# Altium schematic sheet 01- Power Regulators.SchDoc: Power Regulators
size A3; Page Number: 1; Page Size: B; Page Count: 12; Board Rev: B; Project Name: CrossLink-NX Evaluation Board; RevCode: 1.0; Doc: 305-PD-19-0819; DsnPath: C:\Users\HAltinkilit\Downloads\Crosslink-NX-Design-Files\CrossLink-NX-Eval-Brd-Schematic-RevB-191122.DSN; SchematicName: SCHEMATIC1; PageName: 13 - Power Regulators; PageSize: B; TopSchematic: True
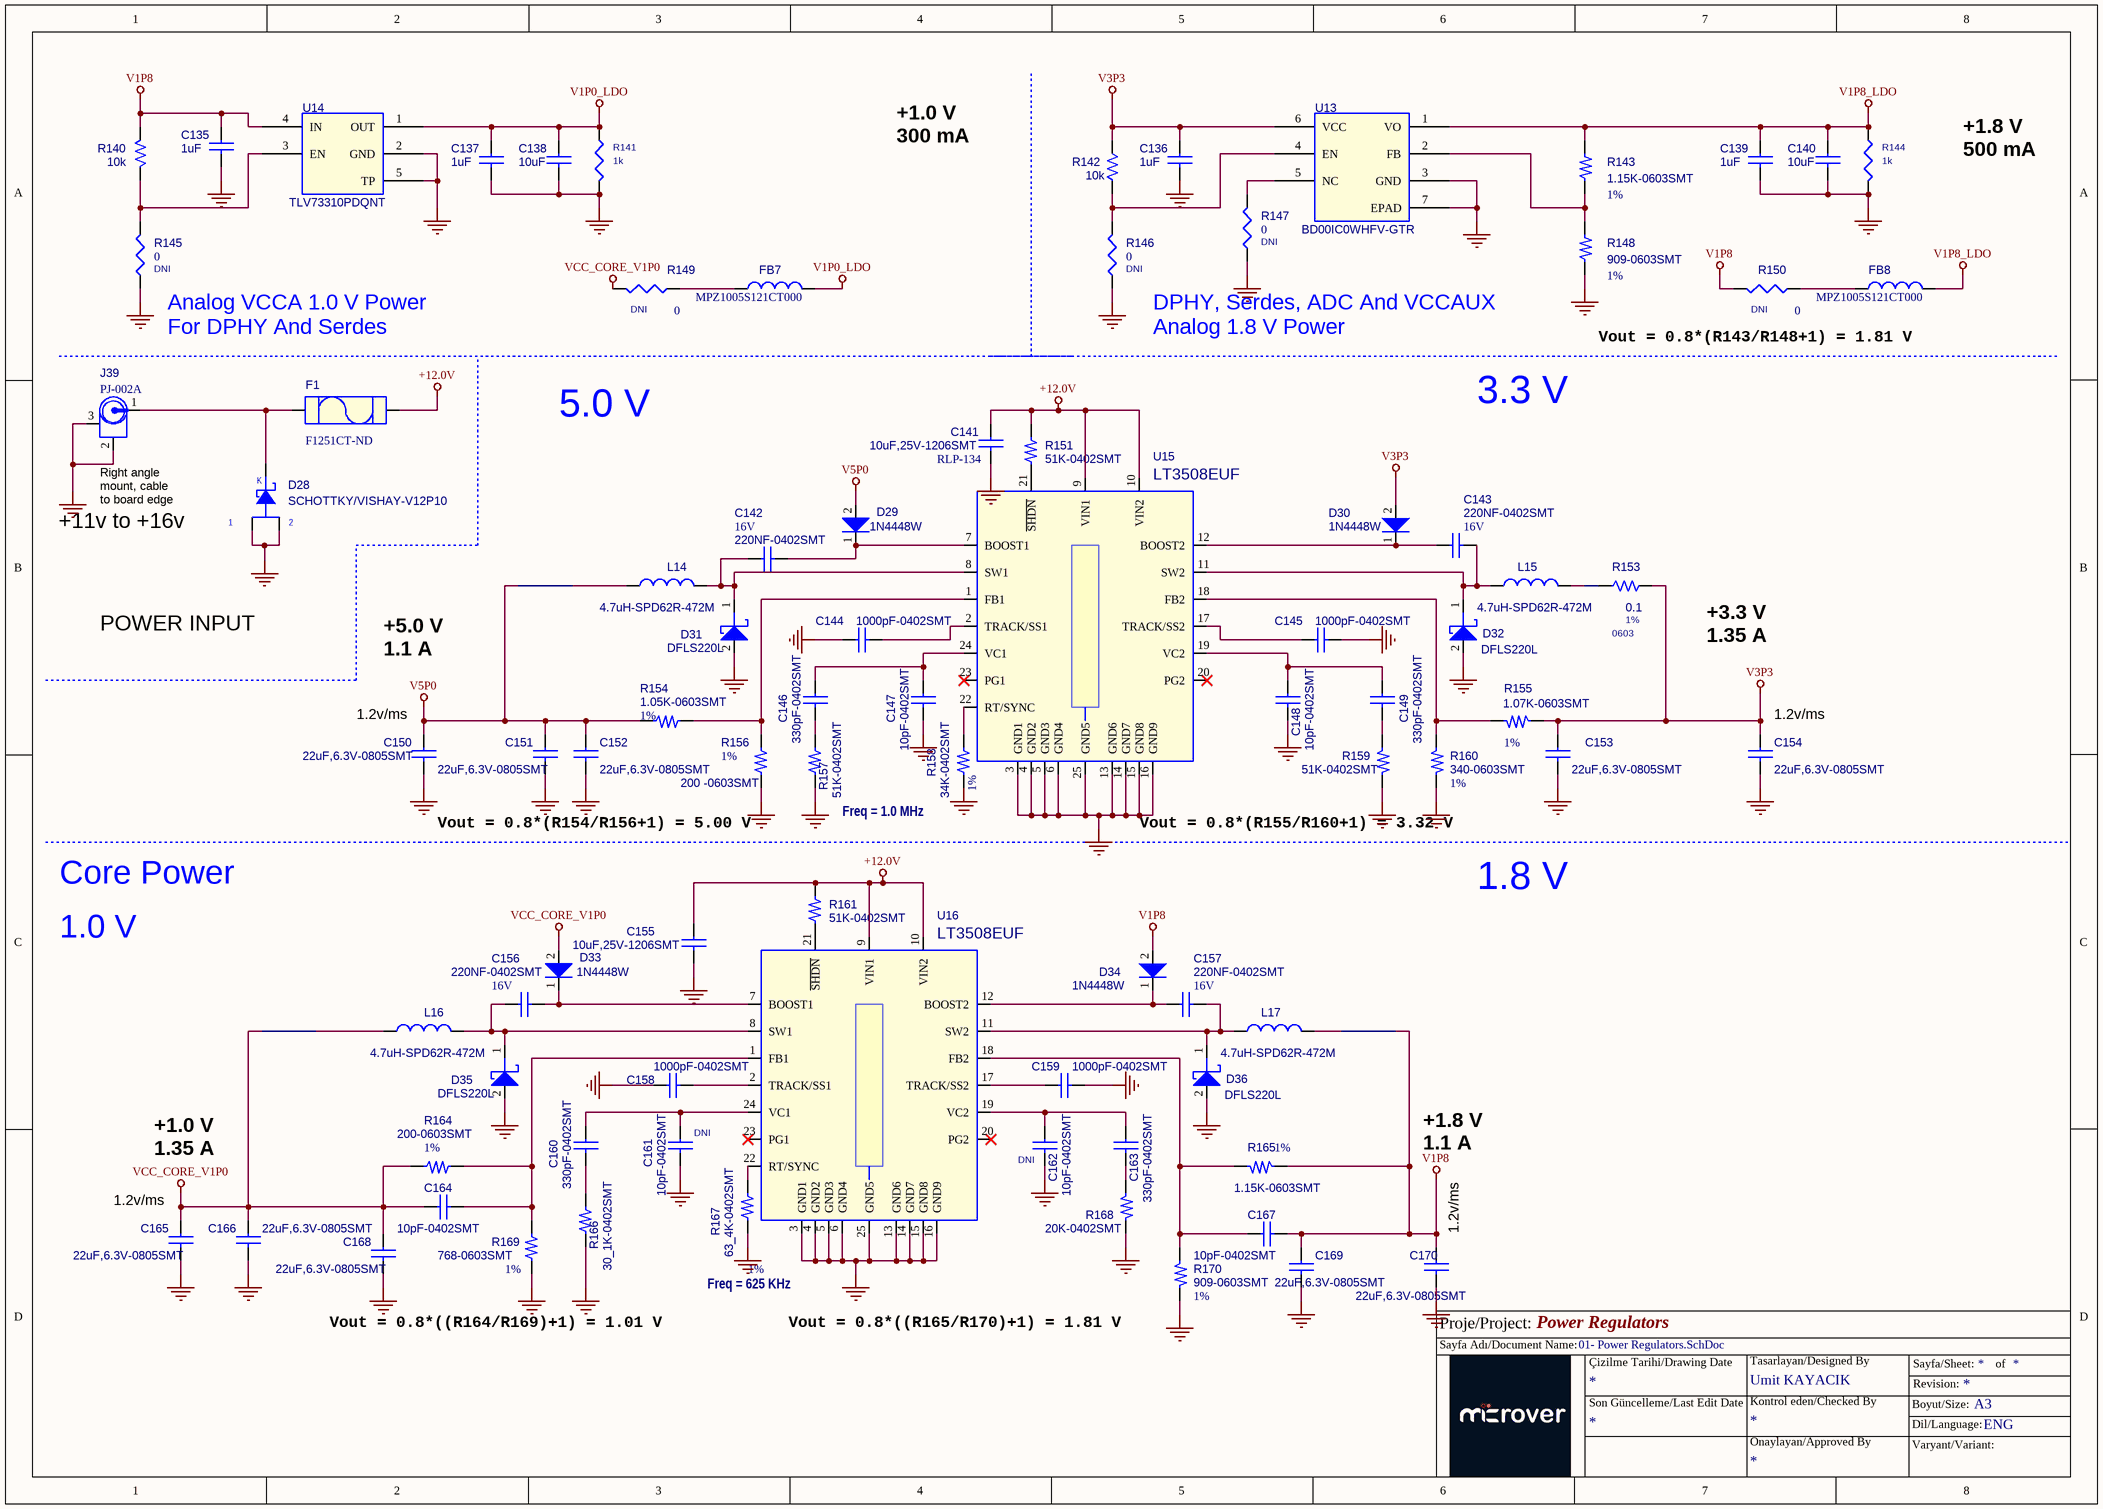
[diagram p0: 01- Power Regulators.SchDoc]

## Parts
C135  1uF  [C0603]
C136  1uF  [C0603]
C137  1uF  [C0603]
C138  10uF  [C0603]
C139  1uF  [C0603]
C140  10uF  [C0603]
C141  10uF,25V-1206SMT  [RLP-134]
C142  220NF-0402SMT  COMPFIXED: 16V  [RLP-130-A]
C143  220NF-0402SMT  COMPFIXED: 16V  [RLP-130-A]
C144  1000pF-0402SMT  [RLP-130-A]
C145  1000pF-0402SMT  [RLP-130-A]
C146  330pF-0402SMT  [RLP-130-A]
C147  10pF-0402SMT  [RLP-130-A]
C148  10pF-0402SMT  [RLP-130-A]
C149  330pF-0402SMT  [RLP-130-A]
C150  22uF,6.3V-0805SMT  [RLP-133]
C151  22uF,6.3V-0805SMT  [RLP-133]
C152  22uF,6.3V-0805SMT  [RLP-133]
C153  22uF,6.3V-0805SMT  [RLP-133]
C154  22uF,6.3V-0805SMT  [RLP-133]
C155  10uF,25V-1206SMT  [RLP-134]
C156  220NF-0402SMT  COMPFIXED: 16V  [RLP-130-A]
C157  220NF-0402SMT  COMPFIXED: 16V  [RLP-130-A]
C158  1000pF-0402SMT  [RLP-130-A]
C159  1000pF-0402SMT  [RLP-130-A]
C160  330pF-0402SMT  [RLP-130-A]
C161  10pF-0402SMT  Populate: DNI  [RLP-130-A]
C162  10pF-0402SMT  Populate: DNI  [RLP-130-A]
C163  330pF-0402SMT  [RLP-130-A]
C164  10pF-0402SMT  [RLP-130-A]
C165  22uF,6.3V-0805SMT  [RLP-133]
C166  22uF,6.3V-0805SMT  [RLP-133]
C167  10pF-0402SMT  [RLP-130-A]
C168  22uF,6.3V-0805SMT  [RLP-133]
C169  22uF,6.3V-0805SMT  [RLP-133]
C170  22uF,6.3V-0805SMT  [RLP-133]
D28  SCHOTTKY/VISHAY-V12P10  [V12P10]
D29  1N4448W  [1N4448W]
D30  1N4448W  [1N4448W]
D31  DFLS220L  [DFLS220L]
D32  DFLS220L  [DFLS220L]
D33  1N4448W  [1N4448W]
D34  1N4448W  [1N4448W]
D35  DFLS220L  [DFLS220L]
D36  DFLS220L  [DFLS220L]
F1  F1251CT-ND  [0154010]
FB7  MPZ1005S121CT000  [FB0402]
FB8  MPZ1005S121CT000  [FB0402]
J39  PJ-002A  [pj_002a_3p]
L14  4.7uH-SPD62R-472M  [SPD62R]
L15  4.7uH-SPD62R-472M  [SPD62R]
L16  4.7uH-SPD62R-472M  [SPD62R]
L17  4.7uH-SPD62R-472M  [SPD62R]
R140  10k  [R0402]
R141  1k  [R0402]
R142  10k  [R0402]
R143  1.15K-0603SMT  COMPFIXED: 1%  [RLP-101]
R144  1k  [R0402]
R145  0  Assy: DNI  [R0402]
R146  0  Assy: DNI  [R0603]
R147  0  Assy: DNI  [R0603]
R148  909-0603SMT  COMPFIXED: 1%  [RLP-101]
R149  0  Assy: DNI  [R0603]
R150  0  Assy: DNI  [R0603]
R151  51K-0402SMT  [RLP-100]
R153  0.1  Tollerance: 1%  [0603]
R154  1.05K-0603SMT  COMPFIXED: 1%  [RLP-101]
R155  1.07K-0603SMT  COMPFIXED: 1%  [RLP-101]
R156  200 -0603SMT  COMPFIXED: 1%  [RLP-101]
R157  51K-0402SMT  [RLP-100]
R158  34K-0402SMT  COMPGROUP: Freq = 1.0 MHz  COMPFIXED: 1%  [RLP-100]
R159  51K-0402SMT  [RLP-100]
R160  340-0603SMT  COMPFIXED: 1%  [RLP-101]
R161  51K-0402SMT  [RLP-100]
R164  200-0603SMT  COMPFIXED: 1%  [RLP-101]
R165  1.15K-0603SMT  COMPFIXED: 1%  [RLP-101]
R166  30_1K-0402SMT  [RLP-100]
R167  63_4K-0402SMT  COMPGROUP: Freq = 625 KHz  COMPFIXED: 1%  [RLP-100]
R168  20K-0402SMT  [RLP-100]
R169  768-0603SMT  COMPFIXED: 1%  [RLP-101]
R170  909-0603SMT  COMPFIXED: 1%  [RLP-101]
U13  BD00IC0WHFV-GTR  [6HVSOF_BD00IC0WHFV]
U14  TLV73310PDQNT  [4X2SON]
U15  LT3508EUF  [LT3508EUF]
U16  LT3508EUF  [LT3508EUF]

## Nets
+12.0V: C141.1 C155.1 F1.2 R151.1 R161.1 U15.9(VIN1) U15.10(VIN2) U16.9(VIN1) U16.10(VIN2)
GND: C135.2 C136.2 C137.2 C138.2 C139.2 C140.2 C141.2 C144.1 C145.2 C147.2 C148.2 C150.2 C151.2 C152.2 C153.2 C154.2 C155.2 C158.1 C159.2 C161.2 C162.2 C165.2 C166.2 C168.2 C169.2 C170.2 D28.1(Anode1) D28.2(Anode2) D31.2 D32.2 D35.2 D36.2 J39.2(GND) J39.3(GND) R141.2 R144.2 R145.2 R146.2 R147.2 R148.1 R156.2 R157.2 R158.2 R159.2 R160.2 R166.2 R167.2 R168.2 R169.2 R170.2 U13.3(GND) U13.7(EPAD) U14.2(GND) U14.5(TP) U15.3(GND1) U15.4(GND2) U15.5(GND3) U15.6(GND4) U15.13(GND6) U15.14(GND7) U15.15(GND8) U15.16(GND9) U15.25(GND5) U16.3(GND1) U16.4(GND2) U16.5(GND3) U16.6(GND4) U16.13(GND6) U16.14(GND7) U16.15(GND8) U16.16(GND9) U16.25(GND5)
V1P0_LDO: C137.1 C138.1 FB7.2 R141.1 U14.1(OUT)
V1P8: C135.1 C167.2 C169.1 C170.1 D34.2 L17.1 R140.2 R150.2 R165.1 U14.4(IN)
V1P8_LDO: C139.1 C140.1 FB8.2 R143.2 R144.1 U13.1(VO)
V3P3: C136.1 C153.1 C154.1 D30.2 R142.2 R153.2 R155.1 U13.6(VCC)
V5P0: C150.1 C151.1 C152.1 D29.2 L14.1 R154.1
VCC_CORE_V1P0: C164.1 C165.1 C166.1 C168.1 D33.2 L16.1 R149.2 R164.1
NetC142_1: C142.1 D31.1 L14.2 U15.8(SW1)
NetC142_2: C142.2 D29.1 U15.7(BOOST1)
NetC143_1: C143.1 D30.1 U15.12(BOOST2)
NetC143_2: C143.2 D32.1 L15.2 U15.11(SW2)
NetC144_2: C144.2 U15.2(TRACK/SS1)
NetC145_1: C145.1 U15.17(TRACK/SS2)
NetC146_1: C146.1 C147.1 U15.24(VC1)
NetC146_2: C146.2 R157.1
NetC148_1: C148.1 C149.1 U15.19(VC2)
NetC149_2: C149.2 R159.1
NetC156_1: C156.1 D35.1 L16.2 U16.8(SW1)
NetC156_2: C156.2 D33.1 U16.7(BOOST1)
NetC157_1: C157.1 D34.1 U16.12(BOOST2)
NetC157_2: C157.2 D36.1 L17.2 U16.11(SW2)
NetC158_2: C158.2 U16.2(TRACK/SS1)
NetC159_1: C159.1 U16.17(TRACK/SS2)
NetC160_1: C160.1 C161.1 U16.24(VC1)
NetC160_2: C160.2 R166.1
NetC162_1: C162.1 C163.1 U16.19(VC2)
NetC163_2: C163.2 R168.1
NetC164_2: C164.2 R164.2 R169.1 U16.1(FB1)
NetC167_1: C167.1 R165.2 R170.1 U16.18(FB2)
NetD28_3: D28.3(K) F1.1 J39.1(+5V)
NetFB7_1: FB7.1 R149.1
NetFB8_1: FB8.1 R150.1
NetL15_1: L15.1 R153.1
NetR140_1: R140.1 R145.1 U14.3(EN)
NetR142_1: R142.1 R146.1 U13.4(EN)
NetR143_1: R143.1 R148.2 U13.2(FB)
NetR147_1: R147.1 U13.5(NC)
NetR151_2: R151.2 U15.21(~{SHDN})
NetR154_2: R154.2 R156.1 U15.1(FB1)
NetR155_2: R155.2 R160.1 U15.18(FB2)
NetR158_1: R158.1 U15.22(RT/SYNC)
NetR161_2: R161.2 U16.21(~{SHDN})
NetR167_1: R167.1 U16.22(RT/SYNC)

Not connected (* = marked no-connect by the designer): U15 20(PG2)* 23(PG1)*; U16 20(PG2)* 23(PG1)*

## Notes on the sheet
- +1.0 V
  300 mA
- +1.8 V
  500 mA
- (near R145) Analog VCCA 1.0 V Power
  For DPHY And Serdes
- DPHY, Serdes, ADC And VCCAUX
  Analog 1.8 V Power
- Vout = 0.8*(R143/R148+1) = 1.81 V
- 5.0 V
- 3.3 V
- (near J39) Right angle
  mount, cable
  to board edge
- (near D28) K
- +11v to +16v
- (near D28) 1
- (near D28) 2
- POWER INPUT
- +5.0 V
  1.1 A
- +3.3 V
  1.35 A
- (near C150) 1.2v/ms
- (near C154) 1.2v/ms
- Vout = 0.8*(R154/R156+1) = 5.00 V
- Vout = 0.8*(R155/R160+1) = 3.32 V
- Core Power
- 1.8 V
- 1.0 V
- +1.0 V
  1.35 A
- +1.8 V
  1.1 A
- (near C165) 1.2v/ms
- (near C170) 1.2v/ms
- Vout = 0.8*((R164/R169)+1) = 1.01 V
- Vout = 0.8*((R165/R170)+1) = 1.81 V
- Proje/Project:
- Sayfa Adı/Document Name:
- Çizilme Tarihi/Drawing Date
- Umit KAYACIK
- Tasarlayan/Designed By
- Sayfa/Sheet:
- Revision:
- of
- Son Güncelleme/Last Edit Date
- Kontrol eden/Checked By
- Onaylayan/Approved By
- Boyut/Size:
- Varyant/Variant:
- Dil/Language:
- A3
- ENG

## Library data of the parts
C135 = CAP NP: CAP CER 10UF 10V 20% X6S 0603; Part Reference: C135; Manufacturer Part Number: CL10X106MP8NRNC; Manufacturer: Samsung; Value: 1uF; MFG P/N: CL10X106MP8NRNC; Man. Part #: CL10X106MP8NRNC; MFG: Samsung; Assy: -; PCB Footprint: C0603
C136 = CAP NP: CAP CER 10UF 10V 20% X6S 0603; Part Reference: C136; Manufacturer Part Number: CL10X106MP8NRNC; Manufacturer: Samsung; Value: 1uF; MFG P/N: CL10X106MP8NRNC; Man. Part #: CL10X106MP8NRNC; MFG: Samsung; Assy: -; PCB Footprint: C0603
C137 = CAP NP: CAP CER 10UF 10V 20% X6S 0603; Part Reference: C137; Manufacturer Part Number: CL10X106MP8NRNC; Manufacturer: Samsung; Value: 1uF; Assy: -; MFG P/N: CL10X106MP8NRNC; Man. Part #: CL10X106MP8NRNC; MFG: Samsung; PCB Footprint: C0603
C138 = CAP NP: CAP CER 10UF 10V 20% X6S 0603; Part Reference: C138; Man. Part #: CL10X106MP8NRNC; MFG: Samsung; Value: 10uF; Assy: -; Manufacturer: Samsung; MFG P/N: CL10X106MP8NRNC; Manufacturer Part Number: CL10X106MP8NRNC; PCB Footprint: C0603
C139 = CAP NP: CAP CER 10UF 10V 20% X6S 0603; Part Reference: C139; Man. Part #: CL10X106MP8NRNC; MFG: Samsung; Value: 1uF; Assy: -; Manufacturer: Samsung; MFG P/N: CL10X106MP8NRNC; Manufacturer Part Number: CL10X106MP8NRNC; PCB Footprint: C0603
C140 = CAP NP: CAP CER 10UF 10V 20% X6S 0603; Part Reference: C140; Man. Part #: CL10X106MP8NRNC; MFG: Samsung; Value: 10uF; Assy: -; Manufacturer: Samsung; MFG P/N: CL10X106MP8NRNC; Manufacturer Part Number: CL10X106MP8NRNC; PCB Footprint: C0603
C141 = CAP-NP: Part Reference: C141; Value: 10uF,25V-1206SMT; Assy: -; PCB Footprint: RLP-134
C142 = CAP-NP: Part Reference: C142; Value: 220NF-0402SMT; Assy: -; PCB Footprint: RLP-130-A
C143 = CAP-NP: Part Reference: C143; Value: 220NF-0402SMT; Assy: -; PCB Footprint: RLP-130-A
C144 = CAP-NP: Part Reference: C144; Value: 1000pF-0402SMT; Assy: -; PCB Footprint: RLP-130-A
C145 = CAP-NP: Part Reference: C145; Value: 1000pF-0402SMT; Assy: -; PCB Footprint: RLP-130-A
C146 = CAP-NP: Part Reference: C146; Value: 330pF-0402SMT; Assy: -; PCB Footprint: RLP-130-A
C147 = CAP-NP: Part Reference: C147; Value: 10pF-0402SMT; Assy: -; PCB Footprint: RLP-130-A
C148 = CAP-NP: Part Reference: C148; Value: 10pF-0402SMT; Assy: -; PCB Footprint: RLP-130-A
C149 = CAP-NP: Part Reference: C149; Value: 330pF-0402SMT; Assy: -; PCB Footprint: RLP-130-A
C150 = CAP-NP: CAP CER 22UF 10V X5R 0805; Part Reference: C150; Manufacturer: Samsung; Manufacturer Part Number: CL21A226KPCLRNC; Value: 22uF,6.3V-0805SMT; Assy: -; PCB Footprint: RLP-133
C151 = CAP-NP: CAP CER 22UF 10V X5R 0805; Part Reference: C151; Manufacturer: Samsung; Manufacturer Part Number: CL21A226KPCLRNC; Value: 22uF,6.3V-0805SMT; Assy: -; PCB Footprint: RLP-133
C152 = CAP-NP: CAP CER 22UF 10V X5R 0805; Part Reference: C152; Manufacturer: Samsung; Manufacturer Part Number: CL21A226KPCLRNC; Value: 22uF,6.3V-0805SMT; Assy: -; PCB Footprint: RLP-133
C153 = CAP-NP: CAP CER 22UF 10V X5R 0805; Part Reference: C153; Manufacturer Part Number: CL21A226KPCLRNC; Manufacturer: Samsung; Value: 22uF,6.3V-0805SMT; Assy: -; PCB Footprint: RLP-133
C154 = CAP-NP: CAP CER 22UF 10V X5R 0805; Part Reference: C154; Manufacturer Part Number: CL21A226KPCLRNC; Manufacturer: Samsung; Value: 22uF,6.3V-0805SMT; Assy: -; PCB Footprint: RLP-133
C155 = CAP-NP: Part Reference: C155; Value: 10uF,25V-1206SMT; Assy: -; PCB Footprint: RLP-134
C156 = CAP-NP: Part Reference: C156; Value: 220NF-0402SMT; Assy: -; PCB Footprint: RLP-130-A
C157 = CAP-NP: Part Reference: C157; Value: 220NF-0402SMT; Assy: -; PCB Footprint: RLP-130-A
C158 = CAP-NP: Part Reference: C158; Value: 1000pF-0402SMT; Assy: -; PCB Footprint: RLP-130-A
C159 = CAP-NP: Part Reference: C159; Value: 1000pF-0402SMT; Assy: -; PCB Footprint: RLP-130-A
C160 = CAP-NP: Part Reference: C160; Value: 330pF-0402SMT; Assy: -; PCB Footprint: RLP-130-A
C161 = CAP-NP: Part Reference: C161; ASSY: DNI; Value: 10pF-0402SMT; PCB Footprint: RLP-130-A
C162 = CAP-NP: Part Reference: C162; ASSY: DNI; Value: 10pF-0402SMT; PCB Footprint: RLP-130-A
C163 = CAP-NP: Part Reference: C163; Value: 330pF-0402SMT; Assy: -; PCB Footprint: RLP-130-A
C164 = CAP-NP: Part Reference: C164; Value: 10pF-0402SMT; Assy: -; PCB Footprint: RLP-130-A
C165 = CAP-NP: CAP CER 22UF 10V X5R 0805; Part Reference: C165; Manufacturer Part Number: CL21A226KPCLRNC; Manufacturer: Samsung; Value: 22uF,6.3V-0805SMT; Assy: -; PCB Footprint: RLP-133
C166 = CAP-NP: CAP CER 22UF 10V X5R 0805; Part Reference: C166; Manufacturer: Samsung; Manufacturer Part Number: CL21A226KPCLRNC; Value: 22uF,6.3V-0805SMT; Assy: -; PCB Footprint: RLP-133
C167 = CAP-NP: Part Reference: C167; Value: 10pF-0402SMT; Assy: -; PCB Footprint: RLP-130-A
C168 = CAP-NP: CAP CER 22UF 10V X5R 0805; Part Reference: C168; Manufacturer: Samsung; Manufacturer Part Number: CL21A226KPCLRNC; Value: 22uF,6.3V-0805SMT; Assy: -; PCB Footprint: RLP-133
C169 = CAP-NP: CAP CER 22UF 10V X5R 0805; Part Reference: C169; Manufacturer Part Number: CL21A226KPCLRNC; Manufacturer: Samsung; Value: 22uF,6.3V-0805SMT; Assy: -; PCB Footprint: RLP-133
C170 = CAP-NP: CAP CER 22UF 10V X5R 0805; Part Reference: C170; Manufacturer: Samsung; Manufacturer Part Number: CL21A226KPCLRNC; Value: 22uF,6.3V-0805SMT; Assy: -; PCB Footprint: RLP-133
D28 = DIODE SCHOTTKY21: Part Reference: D28; Value: SCHOTTKY/VISHAY-V12P10; Assy: -; PCB Footprint: V12P10
D29 = DIODE_0: Part Reference: D29; Value: 1N4448W; Assy: -; PCB Footprint: 1N4448W
D30 = DIODE_0: Part Reference: D30; Value: 1N4448W; Assy: -; PCB Footprint: 1N4448W
D31 = D-SCHOTTKY_0: Part Reference: D31; Value: DFLS220L; Assy: -; PCB Footprint: DFLS220L
D32 = D-SCHOTTKY_0: Part Reference: D32; Value: DFLS220L; Assy: -; PCB Footprint: DFLS220L
D33 = DIODE_0: Part Reference: D33; Value: 1N4448W; Assy: -; PCB Footprint: 1N4448W
D34 = DIODE_0: Part Reference: D34; Value: 1N4448W; Assy: -; PCB Footprint: 1N4448W
D35 = D-SCHOTTKY_0: Part Reference: D35; Value: DFLS220L; Assy: -; PCB Footprint: DFLS220L
D36 = D-SCHOTTKY_0: Part Reference: D36; Value: DFLS220L; Assy: -; PCB Footprint: DFLS220L
F1 = SMTFUSE_0: 5A Fast-Blo SMT Socketed Fuse; Part Reference: F1; Value: F1251CT-ND; Assy: -; PCB Footprint: 0154010
FB7 = INDUCTOR_1: FERRITE BEAD 120 OHM 0402 1LN; Part Reference: FB7; Manufacturer: TDK Corporation; Value: MPZ1005S121CT000; Assy: -; PCB Footprint: FB0402; Manufacturer Part Number: MPZ1005S121CT000
FB8 = INDUCTOR_1: FERRITE BEAD 120 OHM 0402 1LN; Part Reference: FB8; Manufacturer: TDK Corporation; Value: MPZ1005S121CT000; Assy: -; PCB Footprint: FB0402; Manufacturer Part Number: MPZ1005S121CT000
J39 = 22HP037A: Male Power Jack 2.1mm; Part Reference: J39; Value: PJ-002A; Assy: -; PCB Footprint: pj_002a_3p
L14 = IND: Part Reference: L14; COMPGROUP: CDRH3D18; COMPFIXED: SUMIDA; Value: 4.7uH-SPD62R-472M; Assy: -; PCB Footprint: SPD62R
L15 = IND: Part Reference: L15; COMPFIXED: SUMIDA; COMPGROUP: CDRH3D18C; Value: 4.7uH-SPD62R-472M; Assy: -; PCB Footprint: SPD62R
L16 = IND: Part Reference: L16; COMPFIXED: SUMIDA; COMPGROUP: CDRH3D18; Value: 4.7uH-SPD62R-472M; Assy: -; PCB Footprint: SPD62R
L17 = IND: Part Reference: L17; COMPFIXED: SUMIDA; COMPGROUP: CDRH3D18C; Value: 4.7uH-SPD62R-472M; Assy: -; PCB Footprint: SPD62R
R140 = R_Dup2: RES SMD 4.7K OHM 5% 1/10W 0402; Part Reference: R140; Manufacturer Part Number: ERJ-2GEJ472X; DIST: FLAT; PSpiceTemplate: R^@REFDES %1 %2 ?TOLERANCE|R^@REFDES| @VALUE  ?TOLERANCE|\n.model R^@REFDES RES R=1 DEV=@TOLERANCE%|; VOLTAGE: RVMAX; SLOPE: RSMAX; MAX_TEMP: RTMAX; POWER: RMAX; COMPHEIGHT: 0.000; MEMORY: NO; COMPGROUP: 0; COMPROT: 180; COMPLOC: [970.000,1160.000]; COMPSIDE: TOP; FPLIST: AX/RC05,SM/R_0603; MFG: Panasonic; Value: 10k; DECOUPLER: NO; COMPKEY: NO; COMPLOCKED: NO; COMPFIXED: NO; Manufacturer: Panasonic; MFG P/N: ERJ-2GEJ472X; Assy: -; PCB Footprint: R0402
R141 = RES_1K_1W16_0402_5P: RES SMD 1K OHM 1% 1/10W 0402; Part Reference: R141; Manufacturer Part Number: ERJ-2RKF1001X; Manufacturer: Panasonic; Unit Price (USD): 0.02; Total Area(sq-mm): 0.5; Wattage: 1/16W; DIST: FLAT; MAX_TEMP: RTMAX; MFG P/N: RMCF0402JT1K00; MFG: Stackpole Electronics Inc; TC1: 0; Length(mm): 1; Width(mm): 0.5; TC2: 0; Value: 1k; Assy: -; PCB Footprint: R0402; Reference: R141
R142 = R_Dup2: RES SMD 4.7K OHM 5% 1/10W 0402; Part Reference: R142; Manufacturer: Panasonic; DIST: FLAT; PSpiceTemplate: R^@REFDES %1 %2 ?TOLERANCE|R^@REFDES| @VALUE  ?TOLERANCE|\n.model R^@REFDES RES R=1 DEV=@TOLERANCE%|; VOLTAGE: RVMAX; SLOPE: RSMAX; MAX_TEMP: RTMAX; POWER: RMAX; MFG P/N: ERJ-2GEJ472X; FPLIST: AX/RC05,SM/R_0603; COMPSIDE: TOP; COMPLOC: [970.000,1160.000]; COMPROT: 180; COMPGROUP: 0; COMPFIXED: NO; COMPHEIGHT: 0.000; Value: 10k; MFG: Panasonic; Manufacturer Part Number: ERJ-2GEJ472X; COMPLOCKED: NO; COMPKEY: NO; DECOUPLER: NO; MEMORY: NO; Assy: -; PCB Footprint: R0402
R143 = R_Dup1: Part Reference: R143; Value: 1.15K-0603SMT; Assy: -; PCB Footprint: RLP-101
R144 = RES_1K_1W16_0402_5P: RES SMD 1K OHM 1% 1/10W 0402; Part Reference: R144; Manufacturer Part Number: ERJ-2RKF1001X; Manufacturer: Panasonic; Unit Price (USD): 0.02; Total Area(sq-mm): 0.5; Wattage: 1/16W; DIST: FLAT; MAX_TEMP: RTMAX; MFG P/N: RMCF0402JT1K00; MFG: Stackpole Electronics Inc; TC1: 0; Length(mm): 1; Width(mm): 0.5; TC2: 0; Value: 1k; Assy: -; PCB Footprint: R0402; Reference: R144
R145 = 0R_0603: RES 0.0 OHM 1/10W JUMP 0402 SMD; Manufacturer: Yageo; Manufacturer Part Number: RC0603JR-070RL; Part Reference: R145; Class: Discrete; PCB Footprint: R0603; Digikey P/N: 311-0.0GRTR-ND; Value: 0
R146 = 0R_0603: RES 0.0 OHM 1/10W JUMP 0603 SMD; Manufacturer: Yageo; Manufacturer Part Number: RC0603JR-070RL; Part Reference: R146; Class: Discrete; Digikey P/N: 311-0.0GRTR-ND; Value: 0; PCB Footprint: R0603
R147 = 0R_0603: RES 0.0 OHM 1/10W JUMP 0603 SMD; Manufacturer: Yageo; Manufacturer Part Number: RC0603JR-070RL; Part Reference: R147; Class: Discrete; Digikey P/N: 311-0.0GRTR-ND; Value: 0; PCB Footprint: R0603
R148 = R_Dup1: Part Reference: R148; Value: 909-0603SMT; Assy: -; PCB Footprint: RLP-101
R149 = 0R_0603: RES 0.0 OHM 1/10W JUMP 0603 SMD; Manufacturer: Yageo; Manufacturer Part Number: RC0603JR-070RL; Part Reference: R149; Class: Discrete; Digikey P/N: 311-0.0GRTR-ND; Value: 0; PCB Footprint: R0603
R150 = 0R_0603: RES 0.0 OHM 1/10W JUMP 0603 SMD; Manufacturer: Yageo; Manufacturer Part Number: RC0603JR-070RL; Part Reference: R150; Class: Discrete; Digikey P/N: 311-0.0GRTR-ND; Value: 0; PCB Footprint: R0603
R151 = R_Dup1: Part Reference: R151; Value: 51K-0402SMT; Assy: -; PCB Footprint: RLP-100
R153 = R_Dup2: Part Reference: R153; DIST: FLAT; PSpiceTemplate: R^@REFDES %1 %2 ?TOLERANCE|R^@REFDES| @VALUE  ?TOLERANCE|\n.model R^@REFDES RES R=1 DEV=@TOLERANCE%|; VOLTAGE: RVMAX; SLOPE: RSMAX; MAX_TEMP: RTMAX; POWER: RMAX; FPLIST: AX/RC05,SM/R_0603; COMPSIDE: TOP; COMPLOC: [970.000,1160.000]; COMPROT: 180; COMPGROUP: 0; COMPFIXED: NO; COMPHEIGHT: 0.000; Value: 0.1; Assy: -; COMPLOCKED: NO; COMPKEY: NO; DECOUPLER: NO; MEMORY: NO; PCB Footprint: 0603
R154 = R_Dup1: Part Reference: R154; Value: 1.05K-0603SMT; Assy: -; PCB Footprint: RLP-101
R155 = R_Dup1: Part Reference: R155; Value: 1.07K-0603SMT; Assy: -; PCB Footprint: RLP-101
R156 = R_Dup1: Part Reference: R156; Value: 200 -0603SMT; Assy: -; PCB Footprint: RLP-101
R157 = R_Dup1: Part Reference: R157; COMPFIXED: 1%; Value: 51K-0402SMT; Assy: -; PCB Footprint: RLP-100
R158 = R_Dup1: Part Reference: R158; Value: 34K-0402SMT; Assy: -; PCB Footprint: RLP-100
R159 = R_Dup1: Part Reference: R159; COMPFIXED: 1%; Value: 51K-0402SMT; Assy: -; PCB Footprint: RLP-100
R160 = R_Dup1: Part Reference: R160; Value: 340-0603SMT; Assy: -; PCB Footprint: RLP-101
R161 = R_Dup1: Part Reference: R161; Value: 51K-0402SMT; Assy: -; PCB Footprint: RLP-100
R164 = R_Dup1: Part Reference: R164; Value: 200-0603SMT; Assy: -; PCB Footprint: RLP-101
R165 = R_Dup1: Part Reference: R165; Value: 1.15K-0603SMT; Assy: -; PCB Footprint: RLP-101
R166 = R_Dup1: Part Reference: R166; COMPFIXED: 1%; Value: 30_1K-0402SMT; Assy: -; PCB Footprint: RLP-100
R167 = R_Dup1: Part Reference: R167; Value: 63_4K-0402SMT; Assy: -; PCB Footprint: RLP-100
R168 = R_Dup1: Part Reference: R168; COMPFIXED: 1%; Value: 20K-0402SMT; Assy: -; PCB Footprint: RLP-100
R169 = R_Dup1: Part Reference: R169; Value: 768-0603SMT; Assy: -; PCB Footprint: RLP-101
R170 = R_Dup1: Part Reference: R170; Value: 909-0603SMT; Assy: -; PCB Footprint: RLP-101
U13 = BD00IC0WHFV-GTR: Part Reference: U13; Value: BD00IC0WHFV-GTR; Assy: -; PCB Footprint: 6HVSOF_BD00IC0WHFV
U14 = TLV73310PDQNT: Part Reference: U14; Value: TLV73310PDQNT; Assy: -; PCB Footprint: 4X2SON
U15 = LT3508EUF-QFN24UF-4X4_0: Part Reference: U15; UCOST: $0.00; DES: IC, LINEAR TECH, LTC1563; Value: LT3508EUF; Assy: -; PCB Footprint: LT3508EUF
U16 = LT3508EUF-QFN24UF-4X4_0: Part Reference: U16; UCOST: $0.00; DES: IC, LINEAR TECH, LTC1563; Value: LT3508EUF; Assy: -; PCB Footprint: LT3508EUF